# Altium schematic sheet CAN&QSPI.SchDoc: CAN & QSPI
size A4; DocumentNumber: MB1167; Revision: B.1; SheetNumber: 11; SheetTotal: 17; Project: STM327x6G-EVAL
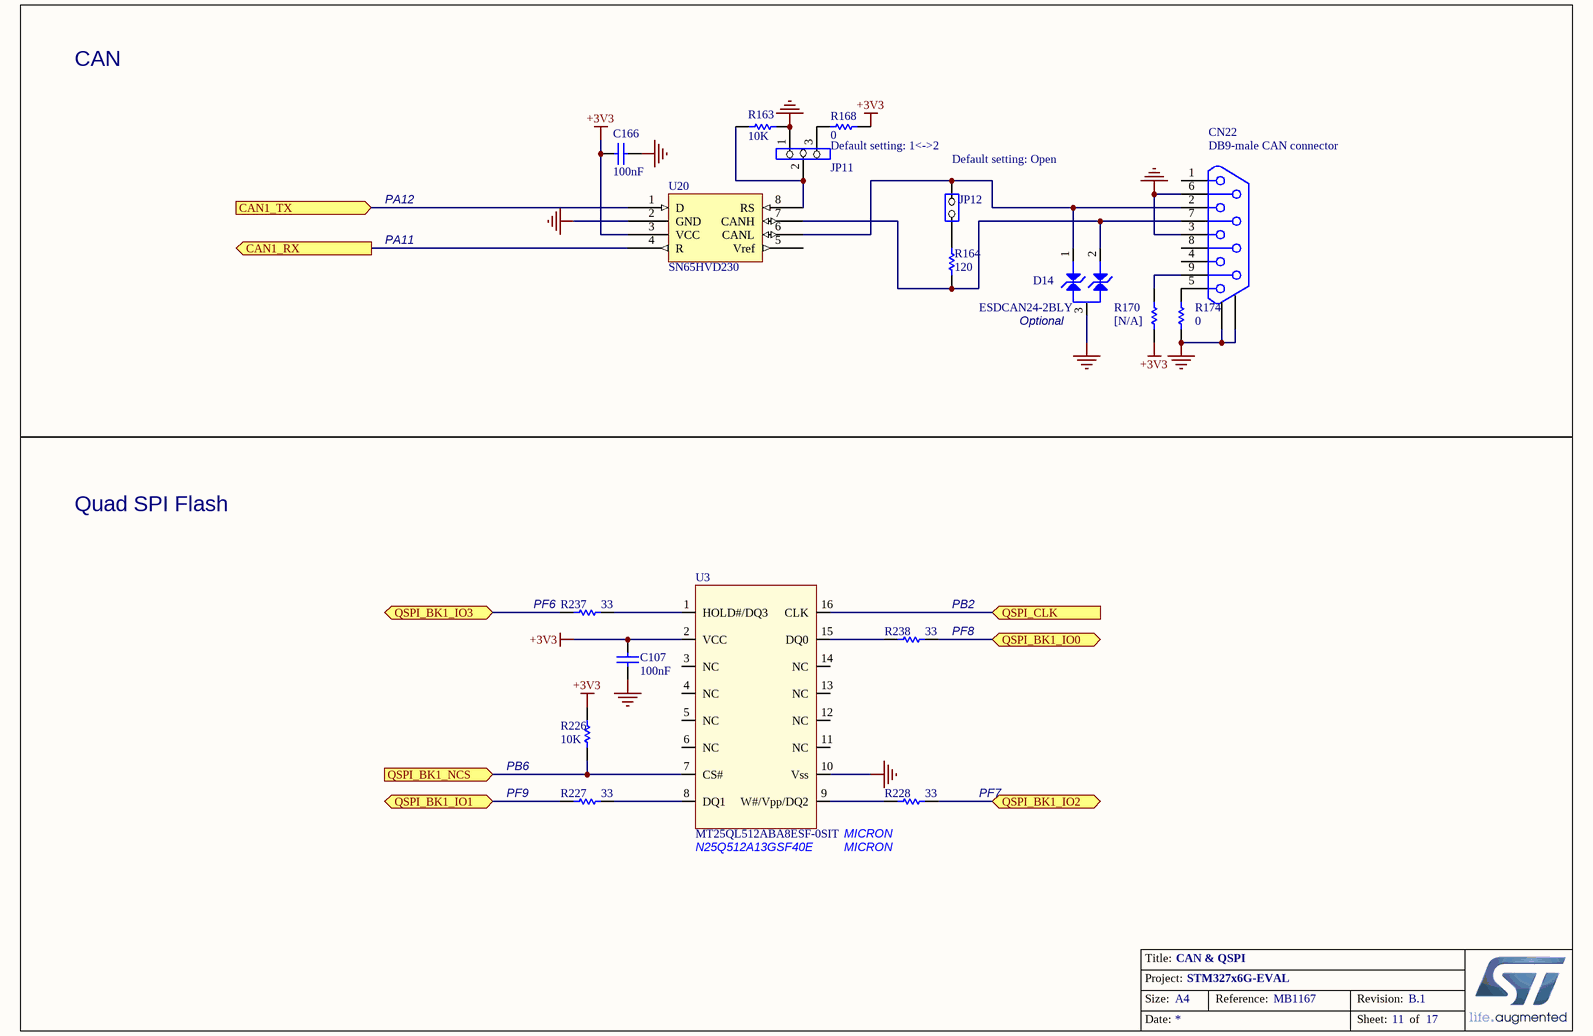
[diagram p0: CAN&QSPI.SchDoc]

## Parts
C107  100nF  [0402C]
C166  100nF  [0603C]
CN22  DB9-male CAN connector  [DB9/M]
D14  ESDCAN24-2BLY  [SOT-23]
JP11  (no value)  [SIP3]
JP12  (no value)  [SIP2]
R163  10K  [0603R]
R164  120  [0603R]
R168  0  [0603R]
R170  [N/A]  [0603R]
R174  0  [0603R]
R226  10K  [0402R]
R227  33  [0603R]
R228  33  [0603R]
R237  33  [0603R]
R238  33  [0603R]
U3  MT25QL512ABA8ESF-0SIT  [SOIC16W_1R27_10R3X10R33]
U20  SN65HVD230  [SOIC8_1R27_4R9X6]

## Ports
CAN1_RX (out), CAN1_TX (in), QSPI_BK1_IO0 (bidir), QSPI_BK1_IO1 (bidir), QSPI_BK1_IO2 (bidir), QSPI_BK1_IO3 (bidir), QSPI_BK1_NCS (in), QSPI_CLK (in)

## Nets
+3V3: C107.1 C166.1 R168.2 R170.1 R226.1 U3.2(VCC) U20.3(VCC)
GND: C107.2 C166.2 CN22.3 CN22.6 CN22.10 CN22.11 D14.3 JP11.1 R163.2 R174.1 U3.10(Vss) U20.2(GND)
CAN1_RX: U20.4(R) ; port CAN1_RX
CAN1_TX: U20.1(D) ; port CAN1_TX
QSPI_BK1_IO0: R238.1 ; port QSPI_BK1_IO0
QSPI_BK1_IO1: R227.2 ; port QSPI_BK1_IO1
QSPI_BK1_IO2: R228.1 ; port QSPI_BK1_IO2
QSPI_BK1_IO3: R237.2 ; port QSPI_BK1_IO3
QSPI_BK1_NCS: R226.2 U3.7(CS#) ; port QSPI_BK1_NCS
QSPI_CLK: U3.16(CLK) ; port QSPI_CLK
NetCN22_2: CN22.2 D14.1 JP12.2(NO) U20.6(CANL)
NetCN22_5: CN22.5 R174.2
NetCN22_7: CN22.7 D14.2 R164.1 U20.7(CANH)
NetCN22_9: CN22.9 R170.2
NetJP11_2: JP11.2 R163.1 U20.8(RS)
NetJP11_3: JP11.3 R168.1
NetJP12_1: JP12.1(COMMON) R164.2
NetR227_1: R227.1 U3.8(DQ1)
NetR228_2: R228.2 U3.9(W#/Vpp/DQ2)
NetR237_1: R237.1 U3.1(HOLD#/DQ3)
NetR238_2: R238.2 U3.15(DQ0)

Not connected (* = marked no-connect by the designer): CN22 1 4 8; U3 3(NC) 4(NC) 5(NC) 6(NC) 11(NC) 12(NC) 13(NC) 14(NC); U20 5(Vref)

## Notes on the sheet
- CAN
- Default setting: 1<->2
- (near JP12) Default setting: Open
- PA12
- PA11
- (near D14) Optional
- Quad SPI Flash
- (near R237) PF6
- (near R238) PF8
- (near R238) PB2
- PB6
- PF9
- (near U3) N25Q512A13GSF40E
- MICRON
- (near R228) PF7
- Title:
- Project:
- Size:
- Date:
- A4
- Reference:
- Sheet:
- Revision:
- of

## Library data of the parts
C107 = Cap: Capacitor; Value: 10nF; Ordered by: Subcon; Published: 8-Jun-2000; Revision: July-2002: Re-released for DXP Platform.; Publisher: Altium Limited
C166 = Cap: Capacitor; Value: 10nF; Published: 8-Jun-2000; Revision: July-2002: Re-released for DXP Platform.; Publisher: Altium Limited
CN22 = DB9-CAN
JP11 = Jumper3
JP12 = JP2
R163 R227 R228 R237 R238 = Res1: Resistor; Value: 1K; Published: 8-Jun-2000; Revision: July-2002: Re-released for DXP Platform.; Publisher: Altium Limited
R164 R168 R170 R174 = res1: Resistor; Value: 1K; Published: 8-Jun-2000; Revision: July-2002: Re-released for DXP Platform.; Publisher: Altium Limited
R226 = res1: Resistor; Value: 1K; Ordered by: Subcon; Published: 8-Jun-2000; Revision: July-2002: Re-released for DXP Platform.; Publisher: Altium Limited
U3 = QSPI_16pins: ECCN_US/EU: 3A991
U20 = SN65HVD230D